# EasyEDA schematic schematic.json
TITLE: MechaController-32; REV: 0.1; Date: 2024-12-23; Sheet: 1/1; Drawn By: ramondeleonca; Company: MechaLeague
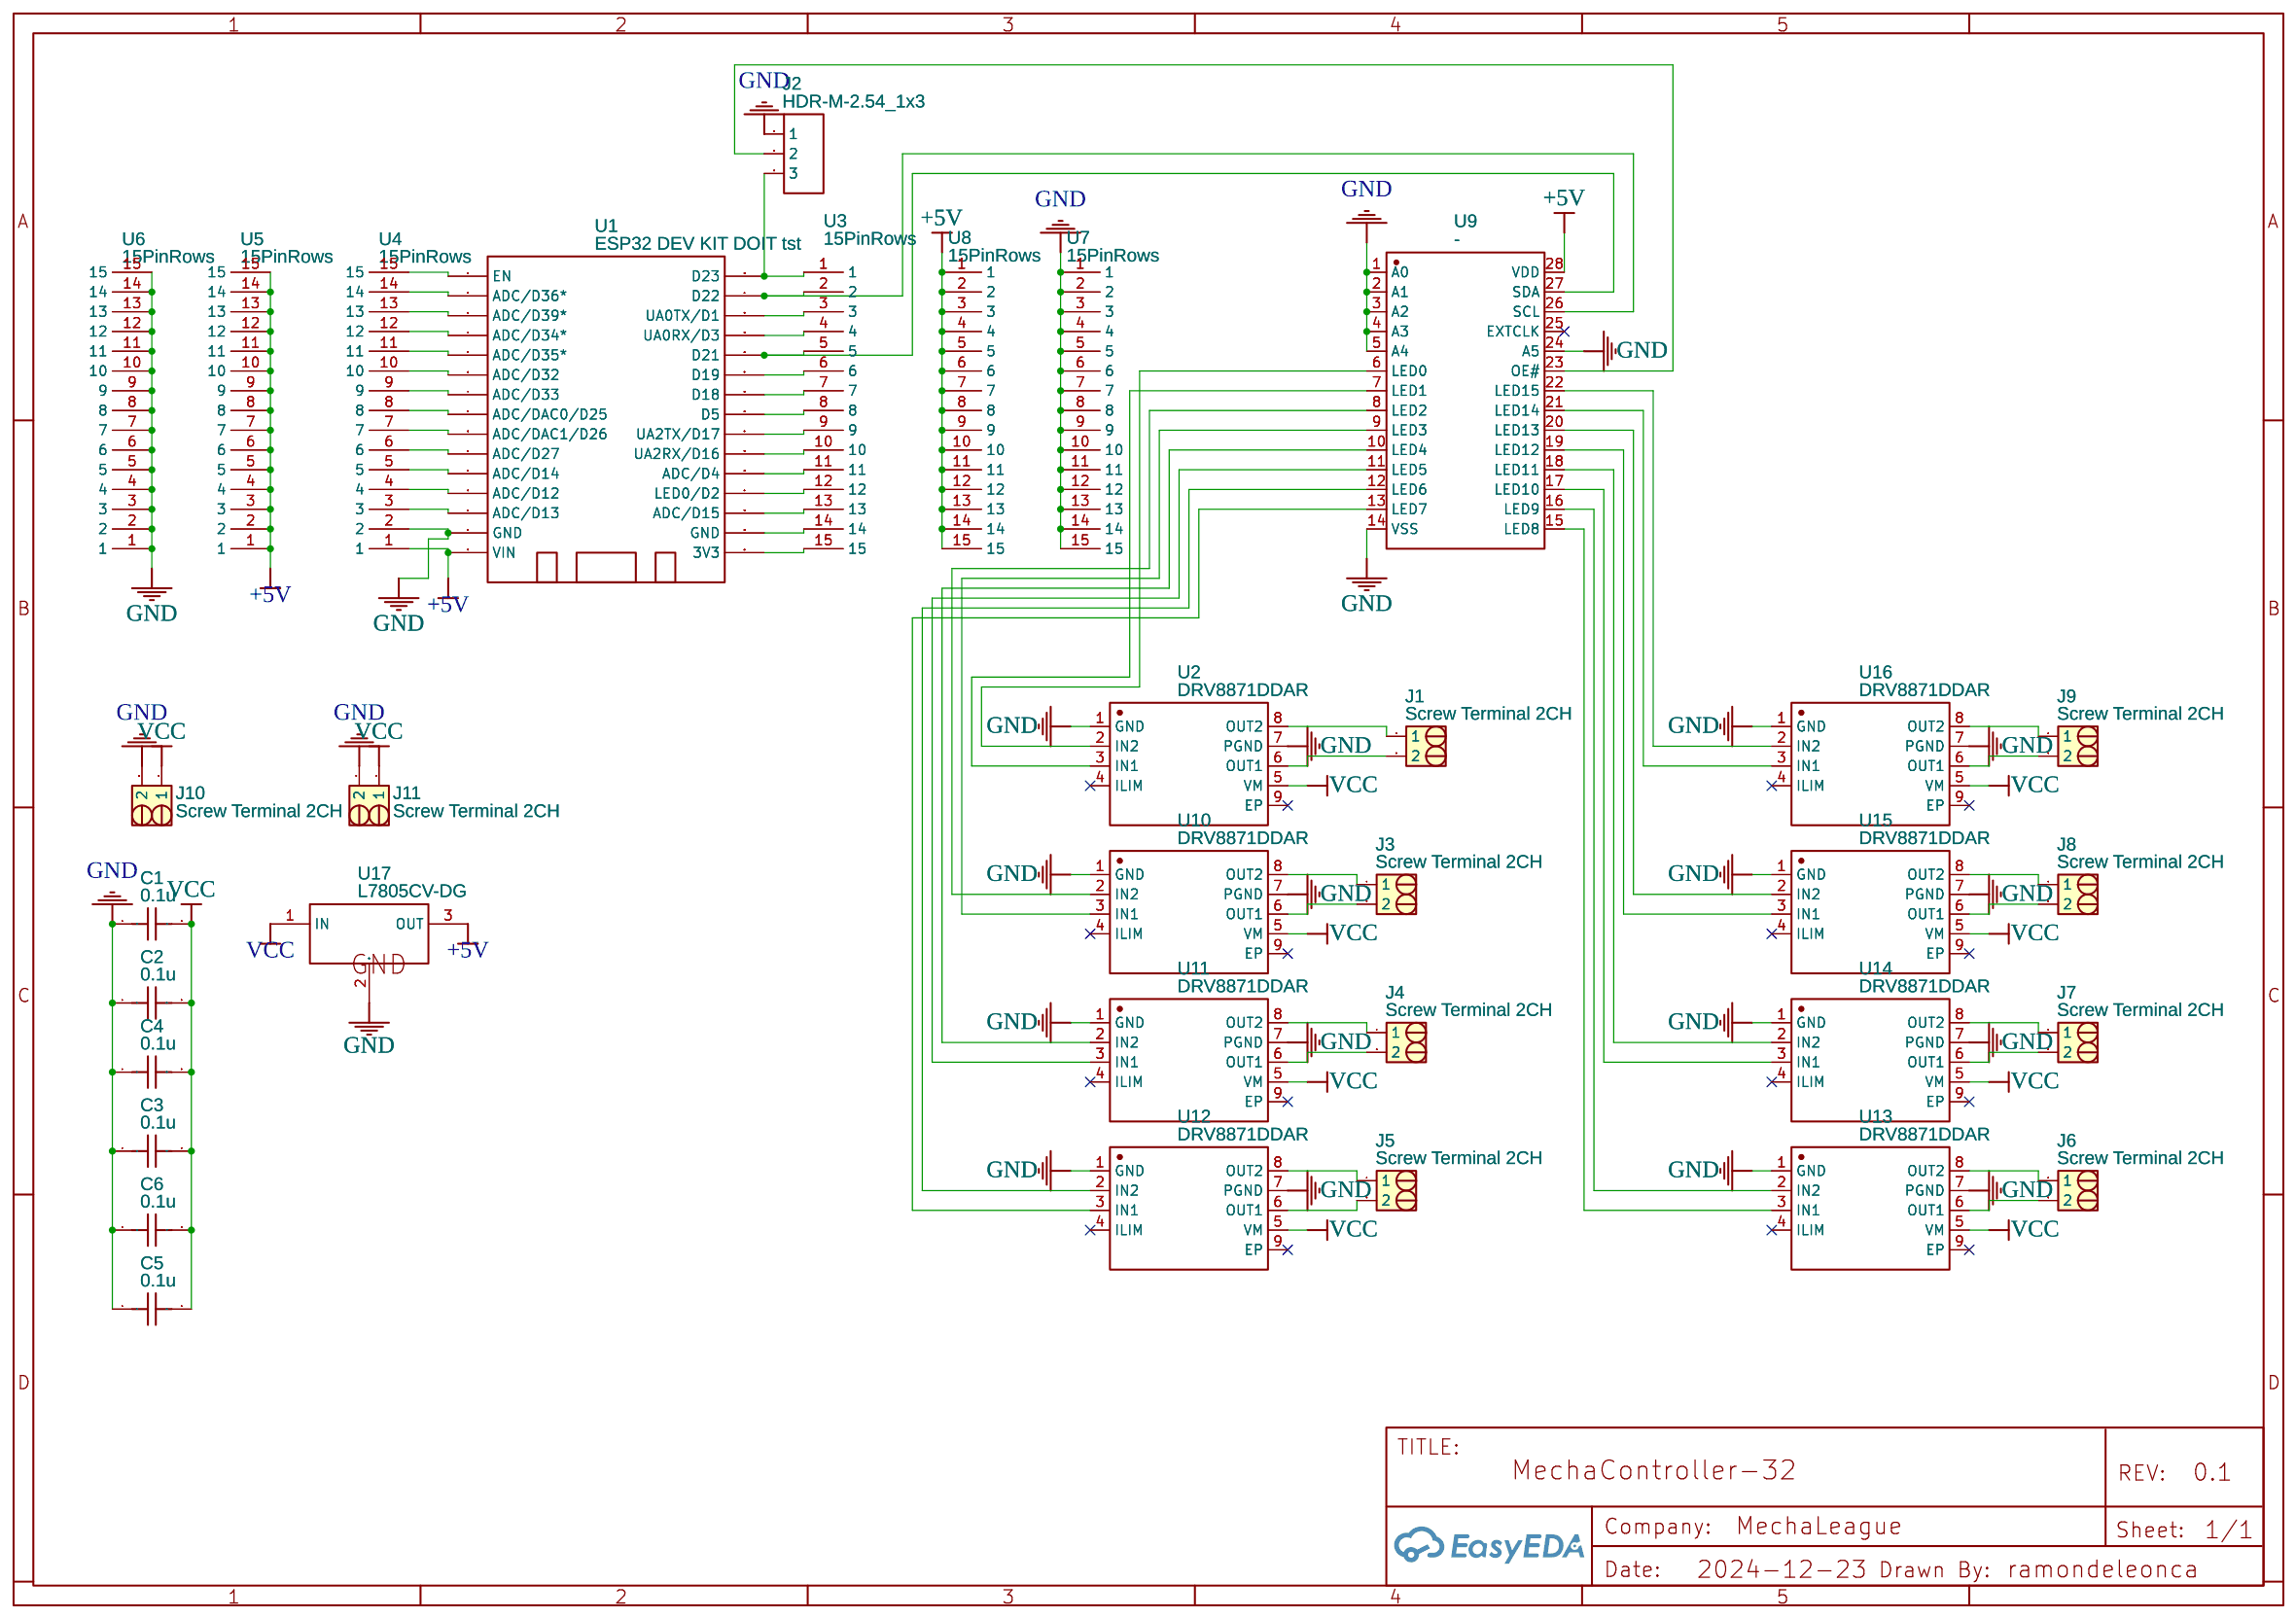
[diagram p0: schematic sheet]

## Parts
C1  0.1u  [CAPACITOR_FOOTPRINT]
C2  0.1u  [CAPACITOR_FOOTPRINT]
C3  0.1u  [CAPACITOR_FOOTPRINT]
C4  0.1u  [CAPACITOR_FOOTPRINT]
C5  0.1u  [CAPACITOR_FOOTPRINT]
C6  0.1u  [CAPACITOR_FOOTPRINT]
J1  Screw Terminal 2CH  [SCREW_TERMINAL_FOOTPRINT]
J2  HDR-M-2.54_1x3  [HDR-M-2.54_1X3]
J3  Screw Terminal 2CH  [SCREW_TERMINAL_FOOTPRINT]
J4  Screw Terminal 2CH  [SCREW_TERMINAL_FOOTPRINT]
J5  Screw Terminal 2CH  [SCREW_TERMINAL_FOOTPRINT]
J6  Screw Terminal 2CH  [SCREW_TERMINAL_FOOTPRINT]
J7  Screw Terminal 2CH  [SCREW_TERMINAL_FOOTPRINT]
J8  Screw Terminal 2CH  [SCREW_TERMINAL_FOOTPRINT]
J9  Screw Terminal 2CH  [SCREW_TERMINAL_FOOTPRINT]
J10  Screw Terminal 2CH  [SCREW_TERMINAL_FOOTPRINT]
J11  Screw Terminal 2CH  [SCREW_TERMINAL_FOOTPRINT]
U1  ESP32 DEV KIT DOIT tst  [DOIT-ESP32-DEVKIT-V1]
U2  DRV8871DDAR  [SO-8_L4.9-W3.9-P1.27-LS6.0-BL-EP]
U3  15PinRows  [15PINROWSFOOTPRINT]
U4  15PinRows  [15PINROWSFOOTPRINT]
U5  15PinRows  [15PINROWSFOOTPRINT]
U6  15PinRows  [15PINROWSFOOTPRINT]
U7  15PinRows  [15PINROWSFOOTPRINT]
U8  15PinRows  [15PINROWSFOOTPRINT]
U9  -  [TSSOP-28_L9.7-W4.4-P0.65-LS6.4-TL]
U10  DRV8871DDAR  [SO-8_L4.9-W3.9-P1.27-LS6.0-BL-EP]
U11  DRV8871DDAR  [SO-8_L4.9-W3.9-P1.27-LS6.0-BL-EP]
U12  DRV8871DDAR  [SO-8_L4.9-W3.9-P1.27-LS6.0-BL-EP]
U13  DRV8871DDAR  [SO-8_L4.9-W3.9-P1.27-LS6.0-BL-EP]
U14  DRV8871DDAR  [SO-8_L4.9-W3.9-P1.27-LS6.0-BL-EP]
U15  DRV8871DDAR  [SO-8_L4.9-W3.9-P1.27-LS6.0-BL-EP]
U16  DRV8871DDAR  [SO-8_L4.9-W3.9-P1.27-LS6.0-BL-EP]
U17  L7805CV-DG  [TO-220-3_L10.0-W4.5-P2.54-L]

## Library data of the parts
C1-C6 = C_0603_US: Contributor: LCEDA_Lib; Package Display: No
J1 J3-J11 = Screw Terminal 2CH: Contributor: muhd.eiman999
J2 = HDR-M-2.54_1x3: Supplier Part: C180248; Supplier: LCSC; Contributor: LCEDA_Lib
U1 = ESP32 DEV KIT DOIT tst: Contributor: daniel514
U2 U10-U16 = DRV8871DDAR: Supplier: LCSC; Manufacturer: TI(德州仪器); Supplier Part: C75864; JLCPCB Part Class: Extended Part
U3-U8 = 15PinRows: Contributor: ramondeleonca
U9 = PCA9685PW,118: Contributor: LCSC; Supplier: LCSC; Supplier Part: C2678753; Manufacturer: NXP(恩智浦); JLCPCB Part Class: Extended Part
U17 = L7805CV-DG: Supplier: LCSC; Manufacturer: ST(意法半导体); Supplier Part: C3795; JLCPCB Part Class: Extended Part

## Nets
+5V: U1.15(VIN) U4.1 U5.1 U5.2 U5.3 U5.4 U5.5 U5.6 U5.7 U5.8 U5.9 U5.10 U5.11 U5.12 U5.13 U5.14 U5.15 U8.1 U8.2 U8.3 U8.4 U8.5 U8.6 U8.7 U8.8 U8.9 U8.10 U8.11 U8.12 U8.13 U8.14 U8.15 U9.28(VDD) U17.3(OUT)
GND: C1.1 C2.1 C3.1 C4.1 C5.1 C6.1 J2.1 J10.2 J11.2 U1.14(GND) U2.1(GND) U2.7(PGND) U4.2 U6.1 U6.2 U6.3 U6.4 U6.5 U6.6 U6.7 U6.8 U6.9 U6.10 U6.11 U6.12 U6.13 U6.14 U6.15 U7.1 U7.2 U7.3 U7.4 U7.5 U7.6 U7.7 U7.8 U7.9 U7.10 U7.11 U7.12 U7.13 U7.14 U7.15 U9.1(A0) U9.2(A1) U9.3(A2) U9.4(A3) U9.5(A4) U9.14(VSS) U9.24(A5) U10.1(GND) U10.7(PGND) U11.1(GND) U11.7(PGND) U12.1(GND) U12.7(PGND) U13.1(GND) U13.7(PGND) U14.1(GND) U14.7(PGND) U15.1(GND) U15.7(PGND) U16.1(GND) U16.7(PGND) U17.2(GND)
VCC: C1.2 C2.2 C3.2 C4.2 C5.2 C6.2 J10.1 J11.1 U2.5(VM) U10.5(VM) U11.5(VM) U12.5(VM) U13.5(VM) U14.5(VM) U15.5(VM) U16.5(VM) U17.1(IN)
Net-(J1-1): J1.1 U2.8(OUT2)
Net-(J1-2): J1.2 U2.6(OUT1)
Net-(J2-2): J2.2 U9.23(OE#)
Net-(J2-3): J2.3 U1.16(D23) U3.1
Net-(J3-1): J3.1 U10.8(OUT2)
Net-(J3-2): J3.2 U10.6(OUT1)
Net-(J4-1): J4.1 U11.8(OUT2)
Net-(J4-2): J4.2 U11.6(OUT1)
Net-(J5-1): J5.1 U12.8(OUT2)
Net-(J5-2): J5.2 U12.6(OUT1)
Net-(J6-1): J6.1 U13.8(OUT2)
Net-(J6-2): J6.2 U13.6(OUT1)
Net-(J7-1): J7.1 U14.8(OUT2)
Net-(J7-2): J7.2 U14.6(OUT1)
Net-(J8-1): J8.1 U15.8(OUT2)
Net-(J8-2): J8.2 U15.6(OUT1)
Net-(J9-1): J9.1 U16.8(OUT2)
Net-(J9-2): J9.2 U16.6(OUT1)
Net-(U1-1): U1.1(EN) U4.15
Net-(U1-2): U1.2(ADC/D36*) U4.14
Net-(U1-3): U1.3(ADC/D39*) U4.13
Net-(U1-4): U1.4(ADC/D34*) U4.12
Net-(U1-5): U1.5(ADC/D35*) U4.11
Net-(U1-6): U1.6(ADC/D32) U4.10
Net-(U1-7): U1.7(ADC/D33) U4.9
Net-(U1-8): U1.8(ADC/DAC0/D25) U4.8
Net-(U1-9): U1.9(ADC/DAC1/D26) U4.7
Net-(U1-10): U1.10(ADC/D27) U4.6
Net-(U1-11): U1.11(ADC/D14) U4.5
Net-(U1-12): U1.12(ADC/D12) U4.4
Net-(U1-13): U1.13(ADC/D13) U4.3
Net-(U1-17): U1.17(D22) U3.2 U9.26(SCL)
Net-(U1-18): U1.18(UA0TX/D1) U3.3
Net-(U1-19): U1.19(UA0RX/D3) U3.4
Net-(U1-20): U1.20(D21) U3.5 U9.27(SDA)
Net-(U1-21): U1.21(D19) U3.6
Net-(U1-22): U1.22(D18) U3.7
Net-(U1-23): U1.23(D5) U3.8
Net-(U1-24): U1.24(UA2TX/D17) U3.9
Net-(U1-25): U1.25(UA2RX/D16) U3.10
Net-(U1-26): U1.26(ADC/D4) U3.11
Net-(U1-27): U1.27(LED0/D2) U3.12
Net-(U1-28): U1.28(ADC/D15) U3.13
Net-(U1-29): U1.29(GND) U3.14
Net-(U1-30): U1.30(3V3) U3.15
Net-(U2-2): U2.2(IN2) U9.6(LED0)
Net-(U2-3): U2.3(IN1) U9.7(LED1)
Net-(U9-8): U9.8(LED2) U10.2(IN2)
Net-(U9-9): U9.9(LED3) U10.3(IN1)
Net-(U9-10): U9.10(LED4) U11.2(IN2)
Net-(U9-11): U9.11(LED5) U11.3(IN1)
Net-(U9-12): U9.12(LED6) U12.2(IN2)
Net-(U9-13): U9.13(LED7) U12.3(IN1)
Net-(U9-15): U9.15(LED8) U13.3(IN1)
Net-(U9-16): U9.16(LED9) U13.2(IN2)
Net-(U9-17): U9.17(LED10) U14.3(IN1)
Net-(U9-18): U9.18(LED11) U14.2(IN2)
Net-(U9-19): U9.19(LED12) U15.3(IN1)
Net-(U9-20): U9.20(LED13) U15.2(IN2)
Net-(U9-21): U9.21(LED14) U16.3(IN1)
Net-(U9-22): U9.22(LED15) U16.2(IN2)

Not connected (* = marked no-connect by the designer): U2 4(ILIM)* 9(EP)*; U9 25(EXTCLK)*; U10 4(ILIM)* 9(EP)*; U11 4(ILIM)* 9(EP)*; U12 4(ILIM)* 9(EP)*; U13 4(ILIM)* 9(EP)*; U14 4(ILIM)* 9(EP)*; U15 4(ILIM)* 9(EP)*; U16 4(ILIM)* 9(EP)*
